# EAGLE design K40_panel_V1 (EAGLE 7.7.0)
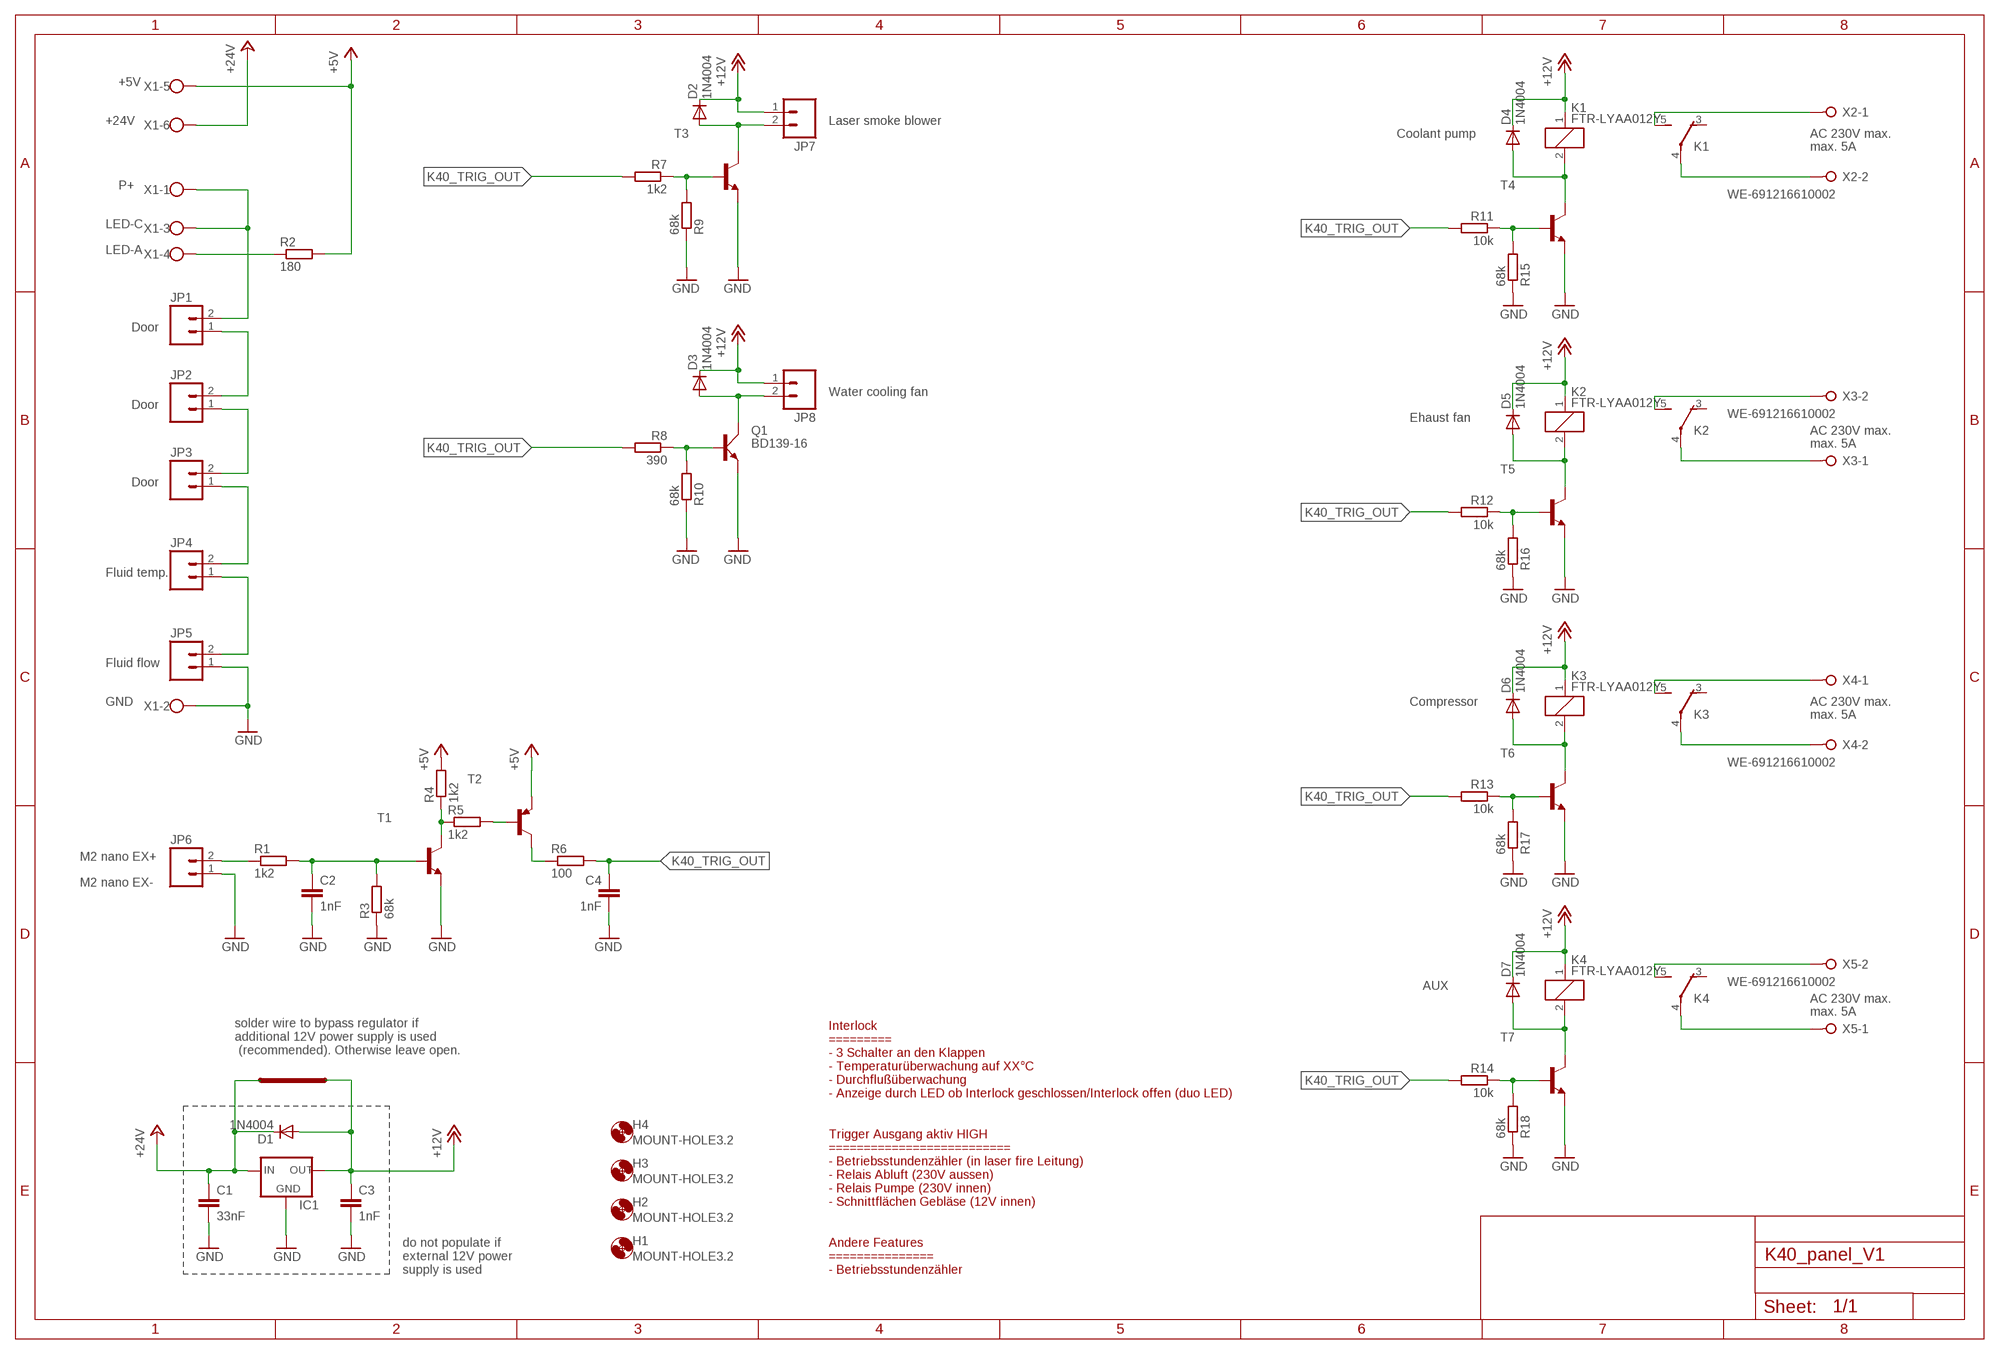
[diagram p0: schematic, sheet 1]

## Parts
C1  33nF  C-EU050-024X044  [C050-024X044]
C2  1nF  C-EU050-024X044  [C050-024X044]
C3  1nF  C-EU050-024X044  [C050-024X044]
C4  1nF  C-EU050-024X044  [C050-024X044]
D1  1N4004  [DO41-10]
D2  1N4004  [DO41-10]
D3  1N4004  [DO41-10]
D4  1N4004  [DO41-10]
D5  1N4004  [DO41-10]
D6  1N4004  [DO41-10]
D7  1N4004  [DO41-10]
H1  MOUNT-HOLE3.2  [3,2]
H2  MOUNT-HOLE3.2  [3,2]
H3  MOUNT-HOLE3.2  [3,2]
H4  MOUNT-HOLE3.2  [3,2]
IC1  78XXS  [78XXS]
JP1  M02POLAR  [MOLEX-1X2]
JP2  M02POLAR  [MOLEX-1X2]
JP3  M02POLAR  [MOLEX-1X2]
JP4  M02POLAR  [MOLEX-1X2]
JP5  M02POLAR  [MOLEX-1X2]
JP6  M02POLAR  [MOLEX-1X2]
JP7  M02POLAR  [MOLEX-1X2]
JP8  M02POLAR  [MOLEX-1X2]
K1  FTR-LYAA012Y  FTR-LYC12  [FTR-LYC]
K2  FTR-LYAA012Y  FTR-LYC12  [FTR-LYC]
K3  FTR-LYAA012Y  FTR-LYC12  [FTR-LYC]
K4  FTR-LYAA012Y  FTR-LYC12  [FTR-LYC]
Q1  BD139-16  BD139  [TO126AV]
R1  1k2  R-EU_0204/7  [0204/7]
R2  180  R-EU_0204/7  [0204/7]
R3  68k  R-EU_0204/7  [0204/7]
R4  1k2  R-EU_0204/7  [0204/7]
R5  1k2  R-EU_0204/7  [0204/7]
R6  100  R-EU_0204/7  [0204/7]
R7  1k2  R-EU_0204/7  [0204/7]
R8  390  R-EU_0204/7  [0204/7]
R9  68k  R-EU_0204/7  [0204/7]
R10  68k  R-EU_0204/7  [0204/7]
R11  10k  R-EU_0204/7  [0204/7]
R12  10k  R-EU_0204/7  [0204/7]
R13  10k  R-EU_0204/7  [0204/7]
R14  10k  R-EU_0204/7  [0204/7]
R15  68k  R-EU_0204/7  [0204/7]
R16  68k  R-EU_0204/7  [0204/7]
R17  68k  R-EU_0204/7  [0204/7]
R18  68k  R-EU_0204/7  [0204/7]
T1  2N4401-NPN-TO92-EBC  [TO92-EBC]
T2  2N4403-PNP-TO92-EBC  [TO92-EBC]
T3  2N4401-NPN-TO92-EBC  [TO92-EBC]
T4  2N4401-NPN-TO92-EBC  [TO92-EBC]
T5  2N4401-NPN-TO92-EBC  [TO92-EBC]
T6  2N4401-NPN-TO92-EBC  [TO92-EBC]
T7  2N4401-NPN-TO92-EBC  [TO92-EBC]
X1  W237-6  [W237-6]
X2  WE-691216610002  W237-2N  [W237-2N]
X3  WE-691216610002  W237-2N  [W237-2N]
X4  WE-691216610002  W237-2N  [W237-2N]
X5  WE-691216610002  W237-2N  [W237-2N]

## Nets
+5V: R2.2 R4.2 T2.E X1.5
+12V: C3.1 D1.A D2.C D3.C D4.C D5.C D6.C D7.C IC1.OUT JP7.1 JP8.1 K1.1 K2.1 K3.1 K4.1
+24V: C1.1 D1.C IC1.IN X1.6
GND: C1.2 C2.2 C3.2 C4.2 IC1.GND JP5.1 JP6.1 Q1.E R3.1 R9.1 R10.1 R15.1 R16.1 R17.1 R18.1 T1.E T3.E T4.E T5.E T6.E T7.E X1.2
K40_TRIG_OUT: C4.1 R6.2 R7.2 R8.2 R11.2 R12.2 R13.2 R14.2
N$1: JP1.2 X1.1 X1.3
N$2: JP1.1 JP2.2
N$3: JP2.1 JP3.2
N$4: JP3.1 JP4.2
N$5: JP4.1 JP5.2
N$6: JP6.2 R1.1
N$7: R2.1 X1.4
N$8: C2.1 R1.2 R3.2 T1.B
N$9: R4.1 R5.1 T1.C
N$10: D2.A JP7.2 T3.C
N$11: R7.1 R9.2 T3.B
N$12: D6.A K3.2 T6.C
N$13: R5.2 T2.B
N$14: R6.1 T2.C
N$15: R13.1 R17.2 T6.B
N$16: K1.4(-1:P) X2.2
N$17: D7.A K4.2 T7.C
N$18: D4.A K1.2 T4.C
N$19: D5.A K2.2 T5.C
N$20: R14.1 R18.2 T7.B
N$21: K1.5(-1:S) X2.1
N$22: R11.1 R15.2 T4.B
N$23: K2.5(-1:S) X3.2
N$24: K2.4(-1:P) X3.1
N$25: R12.1 R16.2 T5.B
N$26: K3.5(-1:S) X4.1
N$27: K3.4(-1:P) X4.2
N$28: K4.5(-1:S) X5.2
N$29: K4.4(-1:P) X5.1
N$32: D3.A JP8.2 Q1.C
N$33: Q1.B R8.1 R10.2
Unconnected: K1.3(-1:O) K2.3(-1:O) K3.3(-1:O) K4.3(-1:O)

## Notes on the sheet
- +5V
- +24V | Laser smoke blower
- Coolant pump | AC 230V max.
- max. 5A
- P+
- LED-C
- LED-A
- Door
- Water cooling fan
- Door
- Ehaust fan
- AC 230V max.
- max. 5A
- Door
- Fluid temp.
- Fluid flow
- GND | Compressor | AC 230V max.
- max. 5A
- M2 nano EX+
- M2 nano EX-
- AUX
- AC 230V max.
- max. 5A
- solder wire to bypass regulator if 
  additional 12V power supply is used
   (recommended). Otherwise leave open.
- do not populate if
  external 12V power
  supply is used
- Interlock
  =========
  - 3 Schalter an den Klappen
  - Temperaturüberwachung auf XX°C
  - Durchflußüberwachung
  - Anzeige durch LED ob Interlock geschlossen/Interlock offen (duo LED)
  
  
  Trigger Ausgang aktiv HIGH
  ==========================
  - Betriebsstundenzähler (in laser fire Leitung)
  - Relais Abluft (230V aussen)
  - Relais Pumpe (230V innen)
  - Schnittflächen Gebläse (12V innen)
  
  
  Andere Features
  ===============
  - Betriebsstundenzähler

## Library data of the parts
C1-C4 = rcl:C-EU: CAPACITOR, European symbol
D1-D7 = diode:1N4004: DIODE general purpose rectifier, 1 A
H1-H4 = holes:MOUNT-HOLE: MOUNTING HOLE with drill center marker
IC1 = v-reg:78XXS: VOLTAGE REGULATOR
JP1-JP8 = SparkFun:M02: Header 2 Standard 2-pin 0.1" header. Use with straight break away headers (SKU : PRT-00116), right angle break away headers (PRT-00553), swiss pins (PRT-00743), machine pins (PRT-00117), and female headers (PRT-00115). Molex polarized connector foot print use with SKU : PRT-08233 with associated crimp pins and housings.
K1-K4 = relay:FTR-LYC: Schmales Netzrelais NETZRELAIS FTR-LYCA024V 1XUM 6A/250VAC Distributor: Conrad electronic Bestell Nr.: 504382 - 62 Source: http://www2.produktinfo.conrad.com/datenblaetter/500000-524999/504382-da-01-de-NETZRELAIS_FTR-LYCA024V_1XUM_6A_250VAC.pdf; OC_FARNELL: unknown; OC_NEWARK: unknown
Q1 = transistor-power:BD139: NPN TRANSISTOR
R1-R18 = resistor:R-EU_: RESISTOR, European symbol
T1 T3-T7 = transistor-neu-to92:*-NPN-: NPN Transistror
T2 = transistor-neu-to92:*-PNP-: PNP Transistror
X1 = con-wago-500:W237-6: WAGO SCREW CLAMP; OC_FARNELL: unknown; OC_NEWARK: unknown
X2-X5 = con-wago-508:W237-2N: WAGO SREW CLAMP; OC_FARNELL: unknown; OC_NEWARK: unknown

## Board
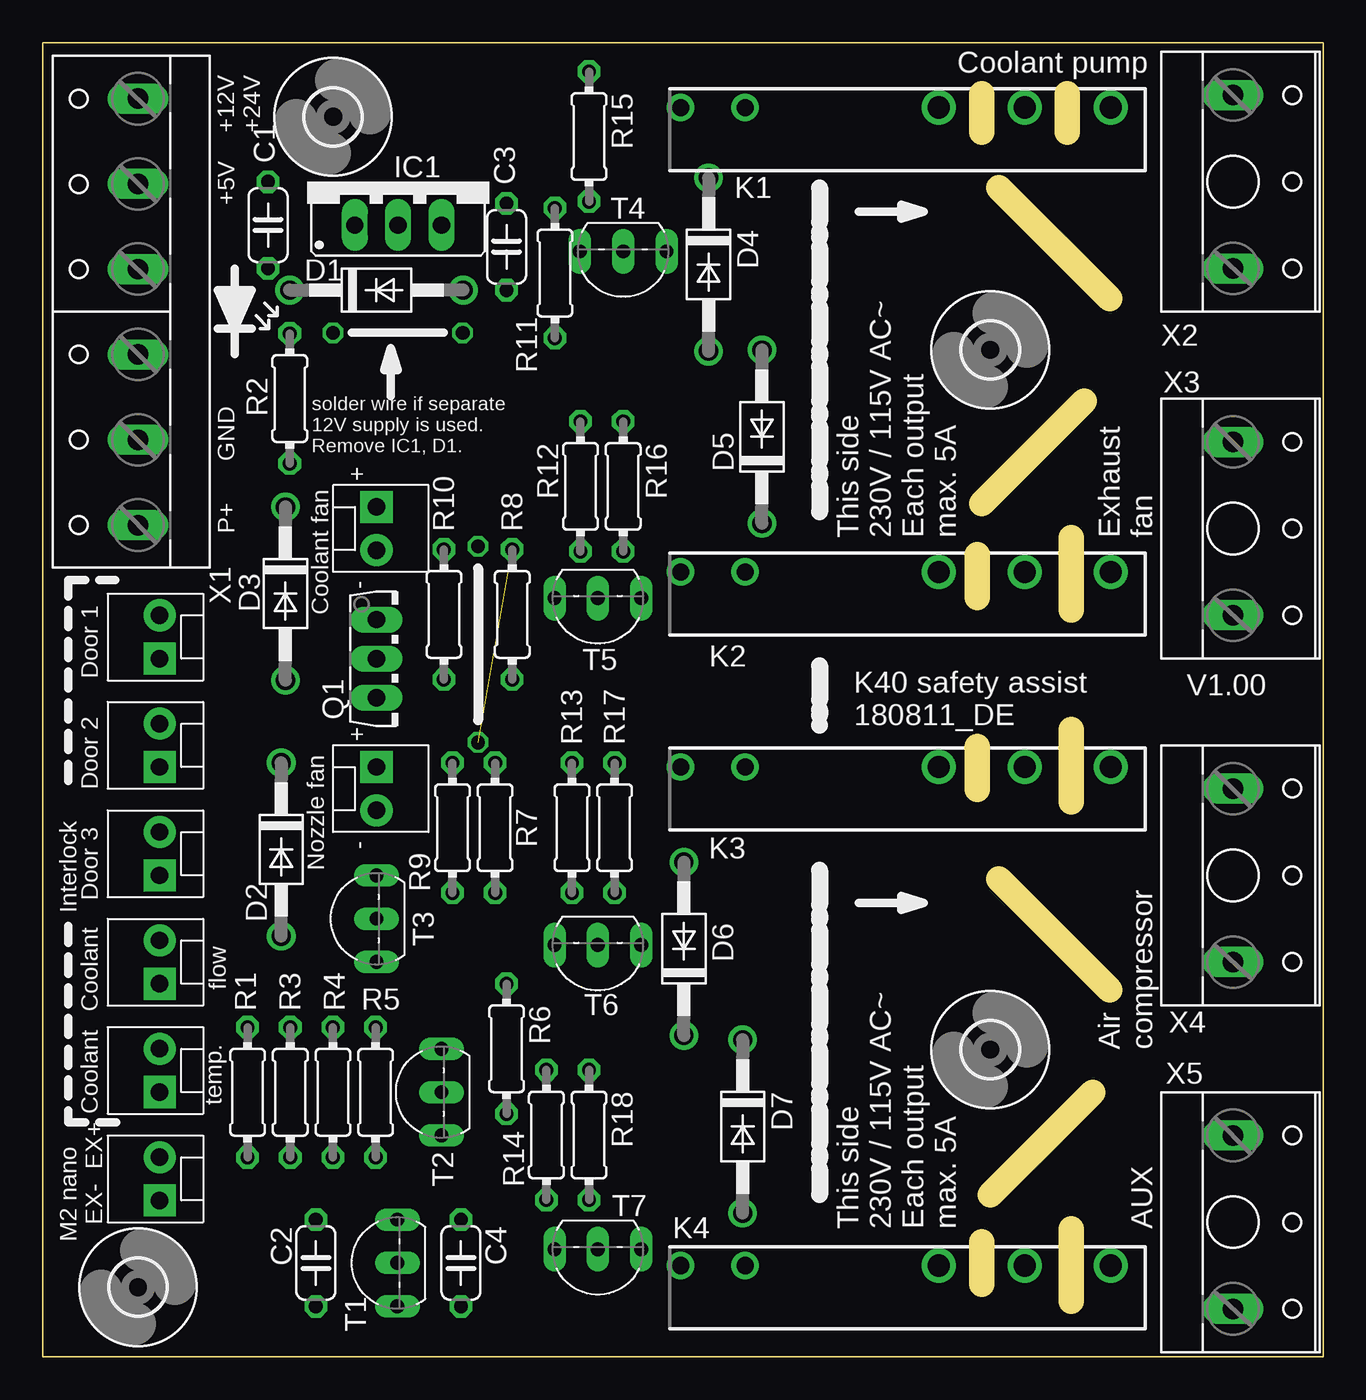
[diagram p1: board, top side]
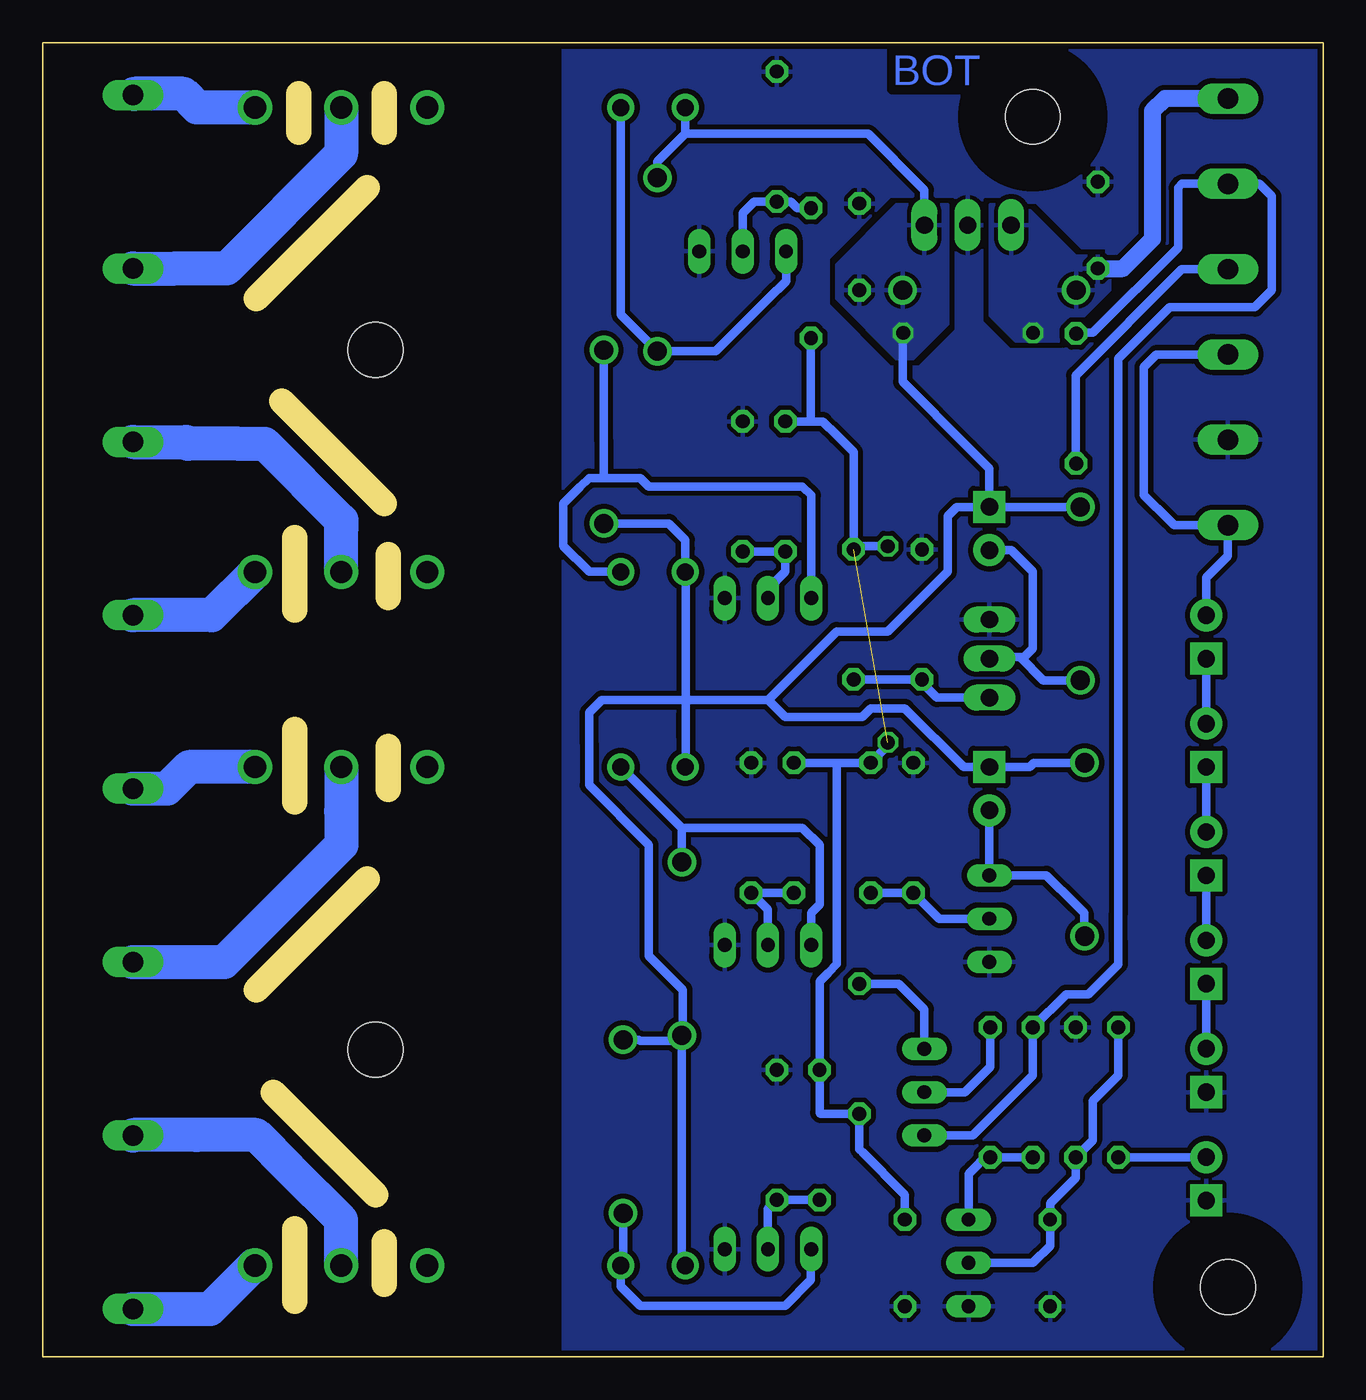
[diagram p2: board, bottom side, seen from below]

Size 75 x 77 mm. Coordinates in mm from the lower left corner, seen from the top.
Outline: 75,77 0,77 0,0 75,0 75,77
Copper layers 16: Bottom 0.035mm
Design rules "default *": minimum track width 0.3mm, minimum drill 0.5mm, track to track 0.3mm, track to pad 0.3mm, pad to pad 0.3mm, via to via 0.3mm, smd to smd 0mil, copper to edge 0.3mm, drill to drill 0.3mm, minimum pad ring 10mil, minimum via ring 8mil, stop-mask expansion 2mil, vias tented up to drill 0mil, thermal gap 10mil
bRestrict: area 20.5,74.2 to 25.2,76.8
Milling: 12 lines

### Footprints (pad centres in the part's own frame; a part is rotated, then mirrored left to right if it is on the bottom)
C050-024X044 = drill 0.813 octagon: 1 -2.54,0; 2 2.54,0
DO41-10 = drill 1.118: A 5.08,0; C -5.08,0
3,2 = hole 3.2: 0,0
78XXS = drill 1.016 long: GND 0,-2.54; IN -2.54,-2.54; OUT 2.54,-2.54
MOLEX-1X2 = drill 1.016 pad 1.88 square: 1 0,0 | drill 1.016 pad 1.88: 2 2.54,0
FTR-LYC = drill 1 pad 1.6: 1 -3.78,0; 2 0,0 | drill 1.3 pad 2: 3 11.34,0; 4 16.38,0; 5 21.42,0
TO126AV = drill 1.016 long: B 2.286,-1.27; C 0,-1.27; E -2.286,-1.27
0204/7 = drill 0.813 octagon: 1 -3.81,0; 2 3.81,0
TO92-EBC = drill 0.813 long: B 0,-1.27; C 2.54,-1.27; E -2.54,-1.27
W237-6 = drill 1.194 long: 1 -12.5,-1.27; 2 -7.5,-1.27; 3 -2.5,-1.27; 4 2.5,-1.27; 5 7.5,-1.27; 6 12.5,-1.27
W237-2N = drill 1.194 long: 1 -5.08,-0.635; 2 5.08,-0.635

### Placement (x,y rotation side)
C1  13.2,66.31 90 top
C2  16,5.5 270 top
C3  27.17,65.04 90 top
C4  24.5,5.5 270 top
D1  19.55,62.5 0 top
D2  13.97,29.73 270 top
D3  14.22,44.72 270 top
D4  39,64 270 top
D5  42.13,53.91 90 top
D6  37.56,23.91 90 top
D7  41,13.5 270 top
H1  17.01,72.66 0 top
H2  5.58,4.08 0 top
H3  55.5,18 0 top
H4  55.5,59 0 top
IC1  20.82,68.85 0 top
JP1  6.85,40.91 90 top
JP2  6.85,34.56 90 top
JP3  6.85,28.21 90 top
JP4  6.85,21.86 90 top
JP5  6.85,15.51 90 top
JP6  6.85,9.16 90 top
JP7  19.55,34.56 270 top
JP8  19.55,49.8 270 top
K1  41.14,73.2 0 top
K2  41.14,45.99 0 top
K3  41.14,34.56 0 top
K4  41.14,5.35 0 top
Q1  20.82,40.91 270 top
R1  12,15.5 90 top
R2  14.47,56.15 90 top
R3  14.5,15.5 270 top
R4  17,15.5 90 top
R5  19.5,15.5 90 top
R6  27.17,18.05 270 top
R7  26.5,31 90 top
R8  27.5,43.5 90 top
R9  24,31 270 top
R10  23.5,43.5 270 top
R11  30,63.5 270 top
R12  31.5,51 90 top
R13  31,31 90 top
R14  29.5,13 90 top
R15  32,71.5 270 top
R16  34,51 270 top
R17  33.5,31 270 top
R18  32,13 270 top
T1  19.5,5.5 90 top
T2  22.09,15.51 90 top
T3  18.28,25.67 90 top
T4  34,63.5 180 top
T5  32.52,43.18 180 top
T6  32.52,22.86 180 top
T7  32.52,5.04 180 top
X1  4.31,61.23 90 top
X2  70.35,68.85 270 top
X3  70.35,48.53 270 top
X4  70.35,28.21 270 top
X5  70.35,7.89 270 top

### Tracks (layer width: path | path; a pad name or v marks a point on that pad's centre or on a via)
+5V
  Bottom 0.5: R2.2 14.43,60 13.5,60 8.5,65 8.5,68.5 8.27,68.73 X1.5 3.73,68.73 3,68 3,62.5 4,61.5 9,61.5 12,58.5 12,26 12,24.31 12,23 13.75,21.25 15.06,21.25 R4.2 17,16.5 20.53,12.97 T2.E
+12V  (via drill 0.8)
  Bottom 0.5: K1.1 37.36,71.66 | 37.36,71.66 26.66,71.66 23.5,68.5 23.36,68.36 IC1.OUT | D3.C JP8.1 | JP8.1 19.55,52.05 20.75,53.25 24.63,57.13 24.63,59.97 v24.6,60 | JP8.1 20.95,49.8 21.45,49.8 22,49.25 22,46 25.5,42.5 28.5,42.5 31.75,39.25 32.5,38.5 | K3.1 37.33,34.59 37.33,36.25 37.33,37.75 | D6.C 37.5,18.89 37.5,21.5 39.5,23.5 39.5,30 43,33.5 43,36 43,37.75 42.25,38.5 37.33,38.5 | 37.36,71.66 39,70.02 D4.C | D6.C 37.89,18.5 40,18.5 40.08,18.58 D7.C | K4.1 37.56,5.55 D6.C | 37.33,38.5 37.33,45.96 K2.1 37.36,47.36 37.36,47.86 38.33,48.83 D5.C | 37.33,38.5 37.33,37.75 | 37.33,37.75 37.33,36.58 | 32.5,38.5 31.5,37.5 29,37.5 27,37.5 26.5,38 24.5,38 21.06,34.56 20.56,34.56 JP7.1 17.19,34.56 17,34.75 16.94,34.81 D2.C | 32.5,38.5 37.33,38.5
  pour Bottom: 22,67.5 22,60.5 24,58.5 25,58.5 28.5,62 28.5,64 25,67.5
+24V  (via drill 0.8)
  Bottom 1: X1.6 9.27,73.73 10,73 10,65.5 11.5,64 11.73,63.77 C1.1
  other vias: 17,60
  pour Bottom: 12.5,64.5 14.5,64.5 17.5,67.5 19.5,67.5 19.5,61 18,59.5 15.5,59.5 12.5,62.5
GND
  pour Bottom (isolate 0.3, rank 2): 0,77 44.5,77 44.5,0 0,0
K40_TRIG_OUT  (via drill 0.8)  (1 unrouted)
  Bottom 0.5: R12.2 30,54.81 | 30,54.81 29.31,54.81 28.5,54 27.5,53 R8.2 27.31,47.5 v25.5,47.5 | R11.2 30,54.81 | 28.48,34.81 R7.2 25.5,35.81 v25.5,36 | 28.48,34.81 R13.2 | 28.48,34.81 28.48,23.02 29,22.5 29.5,22 R14.2 29.5,14.31 29.43,14.24 R6.2 27.17,12.17 27,12 24.5,9.5 C4.1
N$1
  Bottom 0.5: JP1.2 6.85,45.65 6,46.5 5.58,46.92 X1.1 8.73,48.73 9,49 10.5,50.5 10.5,58 9.77,58.73 X1.3
N$2
  Bottom 0.5: JP2.2 JP1.1
N$3
  Bottom 0.5: JP3.2 JP2.1
N$4
  Bottom 0.5: JP4.2 JP3.1
N$5
  Bottom 0.5: JP5.2 JP4.1
N$6
  Bottom 0.5: JP6.2 R1.1
N$7
  Bottom 0.5: X1.4 8.27,63.73 14.5,57.5 14.5,52.37 R2.1
N$8
  Bottom 0.5: T1.B 17,5.5 16,6.5 C2.1 16,9 14.5,10.5 R3.2 13.5,12.69 13.5,15 13,15.5 12,16.5 R1.2
N$9
  Bottom 0.5: R4.1 R5.1 19.81,11.69 20.5,11 20.77,10.73 T1.C
N$10
  Bottom 0.5: JP7.2 T3.C 16.21,28.21 14.5,26.5 14,26 14,24.68 D2.A
N$11
  Bottom 0.5: R7.1 R9.2 22.48,25.67 T3.B
N$12
  Bottom 0.5: T6.C 29.98,26.02 29.5,26.5 29.5,30 30.5,31 37.5,31 | 37.5,31 37.58,31 K3.2 | D6.A 37.56,30.94 37.5,31
N$13
  Bottom 0.5: T2.B 20.99,15.51 19.5,17 R5.2
N$14
  Bottom 0.5: T2.C 23.36,20.36 24.5,21.5 24.86,21.86 R6.1
N$15
  Bottom 0.5: R13.1 R17.2 32.52,26.21 T6.B
N$16
  Bottom 2: K1.4 57.52,70.48 64.23,63.77 67.23,63.77 X2.2
N$17
  Bottom 0.5: D7.A 41,5.49 K4.2 41.14,4.14 40,3 31.5,3 30,4.5 30,6.29 T7.C
N$18
  Bottom 0.5: T4.C 31.46,63.04 32.5,62 35.58,58.92 D4.A 41.14,61.06 K1.2
N$19
  Bottom 0.5: T5.C 29.98,50.48 30.5,51 39.5,51 40,51.5 42,51.5 | D5.A 42.13,53.63 42.13,51.63 42,51.5 | K2.2 43,46 44.5,47.5 44.5,50 43.5,51 43,51.5 42,51.5
N$20
  Bottom 0.5: R14.1 R18.2 32.52,8.67 T7.B
N$21
  Bottom 1.5: 69.64,74 X2.1
  Bottom 2: K1.5 65.95,73.2 66.75,74 69.64,74
N$22
  Bottom 0.5: R11.1 30.81,67.31 31,67.5 31.19,67.69 R15.2 33.31,67.69 34,67 T4.B
N$23
  Bottom 2: K2.5 65.1,43.45 X3.2
N$24
  Bottom 2: K2.4 57.52,48.52 57.5,48.54 57.5,49 62,53.5 63.5,53.5 66.5,53.5 66.61,53.61 X3.1
N$25
  Bottom 0.5: R16.2 R12.1 31.5,46 32.5,45 32.5,44.47 T5.B
N$26
  Bottom 2: K3.5 66.44,34.56 67.5,33.5 67.71,33.29 X4.1
N$27
  Bottom 2: K3.4 57.52,31.98 57.52,30.02 57.5,30 64,23.5 64.37,23.13 66.37,23.13 X4.2
N$28
  Bottom 2: K4.5 62.65,5.35 65,3 65.19,2.81 X5.2
N$29
  Bottom 2: K4.4 57.52,8.02 60.5,11 62.5,13 66,13 69.69,13 X5.1
N$32
  Bottom 0.5: JP8.2 18.26,47.26 17.5,46.5 17,46 17,41.5 17.5,41 17.75,41 | 17.75,41 19.46,41 Q1.C | D3.A 16.39,39.64 17.75,41
N$33
  Bottom 0.5: Q1.B 22.62,38.62 23.5,39.5 23.69,39.69 R10.2 R8.1

### Text on the board
Bottom: BOT
tPlace: Coolant pump | +12V / +24V | +5V | solder wire if separate / 12V supply is used. / Remove IC1, D1. | GND | + | P+ | This side / 230V / 115V AC~ / Each output / max. 5A | Exhaust / fan | - | Coolant fan | Door 1 | V1.00 | K40 safety assist / 180811_DE | + | Door 2 | - | Nozzle fan | Door 3 | Interlock | flow | Coolant | Air / compressor | temp. | Coolant | EX+ | EX- | This side / 230V / 115V AC~ / Each output / max. 5A | AUX | M2 nano
Document: L | N | PE | 12V (separate external powersupply) or / 24V from laser power supply / Solder IC1 if 24V is used or solder / bridge and leave IC1, D1 unconnected / if 12V is used. | +5V from laser / powersupply | M | Interlock LED indicator. / Connect standard 20mA LED. | Coolant pump | GND from laser / powersupply | P or L from laser / powersupply | M | Laser tube door | Exhaust fan | Powersupply door | Cutting area door | M | Interlocks | Water flow switch | Air compressor | Max. temp. switch | M2 nano board rev. 7 or higher | EX+ | EX- | M | AUX